# EAGLE design can bus hat (EAGLE 9.1.3)
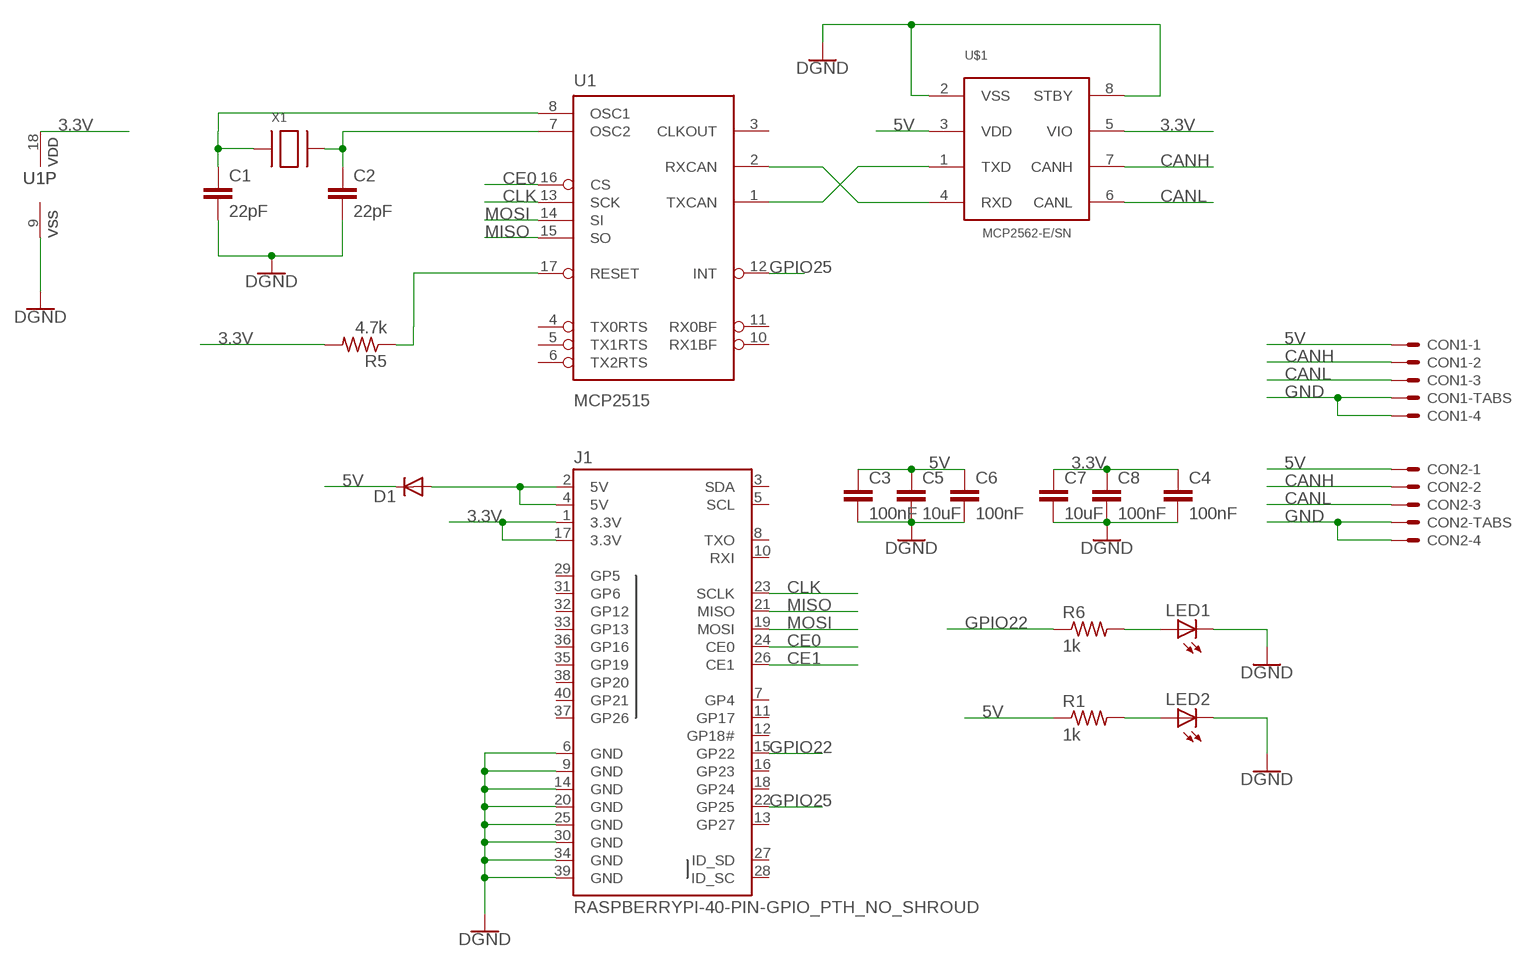
[diagram p0: schematic, sheet 1]

## Parts
C1  22pF  C-EUC0805  [C0805]
C2  22pF  C-EUC0805  [C0805]
C3  100nF  C-EUC0805  [C0805]
C4  100nF  C-EUC0805  [C0805]
C5  10uF  C-EUC0805  [C0805]
C6  100nF  C-EUC0805  [C0805]
C7  10uF  C-EUC0805  [C0805]
C8  100nF  C-EUC0805  [C0805]
CON1  SM04B-GHS-TB  [SM04B-GHS-TB]
CON2  SM04B-GHS-TB  [SM04B-GHS-TB]
D1  DIODE-SOD123  [SOD123]
J1  RASPBERRYPI-40-PIN-GPIO_PTH_NO_SHROUD  [2X20]
LED1  LEDCHIP-LED0805  [CHIP-LED0805]
LED2  LEDCHIP-LED0805  [CHIP-LED0805]
R1  1k  R-US_R0805  [R0805]
R5  4.7k  R-US_R0805  [R0805]
R6  1k  R-US_R0805  [R0805]
U1  MCP2515  MCP2515(MCP2510)SO  [SO18W]
U$1  MCP2562-E/SN  [SOIC8]
X1  XTALNX5032  [NX5032]

## Nets
3.3V: C4.1 C7.1 C8.1 J1.1(3.3V) J1.17(3.3V) R5.2 U1.18(VDD) U$1.5(VIO)
5V: C3.1 C5.1 C6.1 CON1.P$1 CON2.P$1 D1.C R1.1 U$1.3(VDD)
CANH: CON1.P$2 CON2.P$2 U$1.7(CANH)
CANL: CON1.P$3 CON2.P$3 U$1.6(CANL)
CE0: J1.24(CE0) U1.16(CS)
CE1: J1.26(CE1)
CLK: J1.23(SCLK) U1.13(SCK)
GND: C1.2 C2.2 C3.2 C4.2 C5.2 C6.2 C7.2 C8.2 CON1.P$4 CON1.P$5 CON1.P$6 CON2.P$4 CON2.P$5 CON2.P$6 J1.6(GND) J1.9(GND) J1.14(GND) J1.20(GND) J1.25(GND) J1.30(GND) J1.34(GND) J1.39(GND) LED1.C LED2.C U1.9(VSS) U$1.2(VSS) U$1.8(STBY) ; supply symbol labelled DGND
GPIO22: J1.15(GP22) R6.1
GPIO25: J1.22(GP25) U1.12(INT)
MISO: J1.21(MISO) U1.15(SO)
MOSI: J1.19(MOSI) U1.14(SI)
N$1: C1.1 U1.8(OSC1) X1.P$1
N$2: C2.1 U1.7(OSC2) X1.P$2
N$3: U1.1(TXCAN) U$1.1(TXD)
N$4: D1.A J1.2(5V) J1.4(5V)
N$5: U1.2(RXCAN) U$1.4(RXD)
N$6: R5.1 U1.17(RESET)
N$8: LED2.A R1.2
N$10: LED1.A R6.2
Unconnected: J1.3(SDA) J1.5(SCL) J1.7(GP4) J1.8(TXO) J1.10(RXI) J1.11(GP17) J1.12(GP18#) J1.13(GP27) J1.16(GP23) J1.18(GP24) J1.27(ID_SD) J1.28(ID_SC) J1.29(GP5) J1.31(GP6) J1.32(GP12) J1.33(GP13) J1.35(GP19) J1.36(GP16) J1.37(GP26) J1.38(GP20) J1.40(GP21) U1.3(CLKOUT) U1.4(TX0RTS) U1.5(TX1RTS) U1.6(TX2RTS) U1.10(RX1BF) U1.11(RX0BF)

## Library data of the parts
C1-C8 = rcl:C-EU: CAPACITOR, European symbol; SPICEPREFIX: C
CON1 CON2 = ARVP:SM04B-GHS-TB
D1 = _mod_diode:DIODE-: DIODE
J1 = SparkFun-Connectors:RASPBERRYPI-40-PIN-GPIO: Raspberry Pi GPIO Header 2x20 pin connector, as found on B, B+, A+ models. Both shrouded PTH and SMT versions available. SparkFun Products: GPIO Shrouded Header <https://www.sparkfun.com/products/13054>- PTH SparkFun Pi Wedge (Preassembled) <https://www.sparkfun.com/products/13717>
LED1 LED2 = led:LED: LED OSRAM: - CHIPLED LG R971, LG N971, LY N971, LG Q971, LY Q971, LO R971, LY R971 LH N974, LH R974 LS Q976, LO Q976, LY Q976 LO Q996 - Hyper CHIPLED LW Q18S LB Q993, LB Q99A, LB R99A - SideLED LS A670, LO A670, LY A670, LG A670, LP A670 LB A673, LV A673, LT A673, LW A673 LH A674 LY A675 LS A676, LA A676, LO A676, LY A676, LW A676 LS A679, LY A679, LG A679 - Hyper Micro SIDELED® LS Y876, LA Y876, LO Y876, LY Y876 LT Y87S - SmartLED LW L88C, LW L88S LB L89C, LB L89S, LG L890 LS L89K, LO L89K, LY L89K LS L896, LA L896, LO L896, LY L896 - TOPLED LS T670, LO T670, LY T670, LG T670, LP T670 LSG T670, LSP T670, LSY T670, LOP T670, LYG T670 LG T671, LOG T671, LSG T671 LB T673, LV T673, LT T673, LW T673 LH T674 LS T676, LA T676, LO T676, LY T676, LB T676, LH T676, LSB T676, LW T676 LB T67C, LV T67C, LT T67C, LS T67K, LO T67K, LY T67K, LW E67C LS E67B, LA E67B, LO E67B, LY E67B, LB E67C, LV E67C, LT E67C LW T67C LS T679, LY T679, LG T679 LS T770, LO T770, LY T770, LG T770, LP T770 LB T773, LV T773, LT T773, LW T773 LH T774 LS E675, LA E675, LY E675, LS T675 LS T776, LA T776, LO T776, LY T776, LB T776 LHGB T686 LT T68C, LB T68C - Hyper Mini TOPLED® LB M676 - Mini TOPLED Santana® LG M470 LS M47K, LO M47K, LY M47K Source: http://www.osram.convergy.de LUXEON: - LUMILED® LXK2-PW12-R00, LXK2-PW12-S00, LXK2-PW14-U00, LXK2-PW14-V00 LXK2-PM12-R00, LXK2-PM12-S00, LXK2-PM14-U00 LXK2-PE12-Q00, LXK2-PE12-R00, LXK2-PE12-S00, LXK2-PE14-T00, LXK2-PE14-U00 LXK2-PB12-K00, LXK2-PB12-L00, LXK2-PB12-M00, LXK2-PB14-N00, LXK2-PB14-P00, LXK2-PB14-Q00 LXK2-PR12-L00, LXK2-PR12-M00, LXK2-PR14-Q00, LXK2-PR14-R00 LXK2-PD12-Q00, LXK2-PD12-R00, LXK2-PD12-S00 LXK2-PH12-R00, LXK2-PH12-S00 LXK2-PL12-P00, LXK2-PL12-Q00, LXK2-PL12-R00 Source: www.luxeon.com KINGBRIGHT: KA-3528ASYC Source: www.kingbright.com
R1 R5 R6 = rcl:R-US_: RESISTOR, American symbol; SPICEPREFIX: R
U1 = SparkFun-IC-Comms:MCP2515(MCP2510): CAN controller with SPI interface The MCP2515 controller supercedes the MCP2510 while addressing all errata associated with it. The two devices are pin compatible, either can be used with this device. 18-pin package SOIC Simple SPI interface to any MCU. One-shot mode ensures message transmission is attempted only once Databyte filtering Start-of-Frame (SOF) output Low-power CMOS Technology Datasheet <http://www.sparkfun.com/datasheets/DevTools/Arduino/MCP2515.pdf> SparkFun Products CAN-BUS Shield <https://www.sparkfun.com/products/13262> (DEV-13262); PROD_ID: IC-09906
U$1 = SPEAR:MCP2562-E/SN
X1 = adafruit:XTAL: Low cost SMT crystals, no capacitors included http://www.ladyada.net/library/eagle

## Board
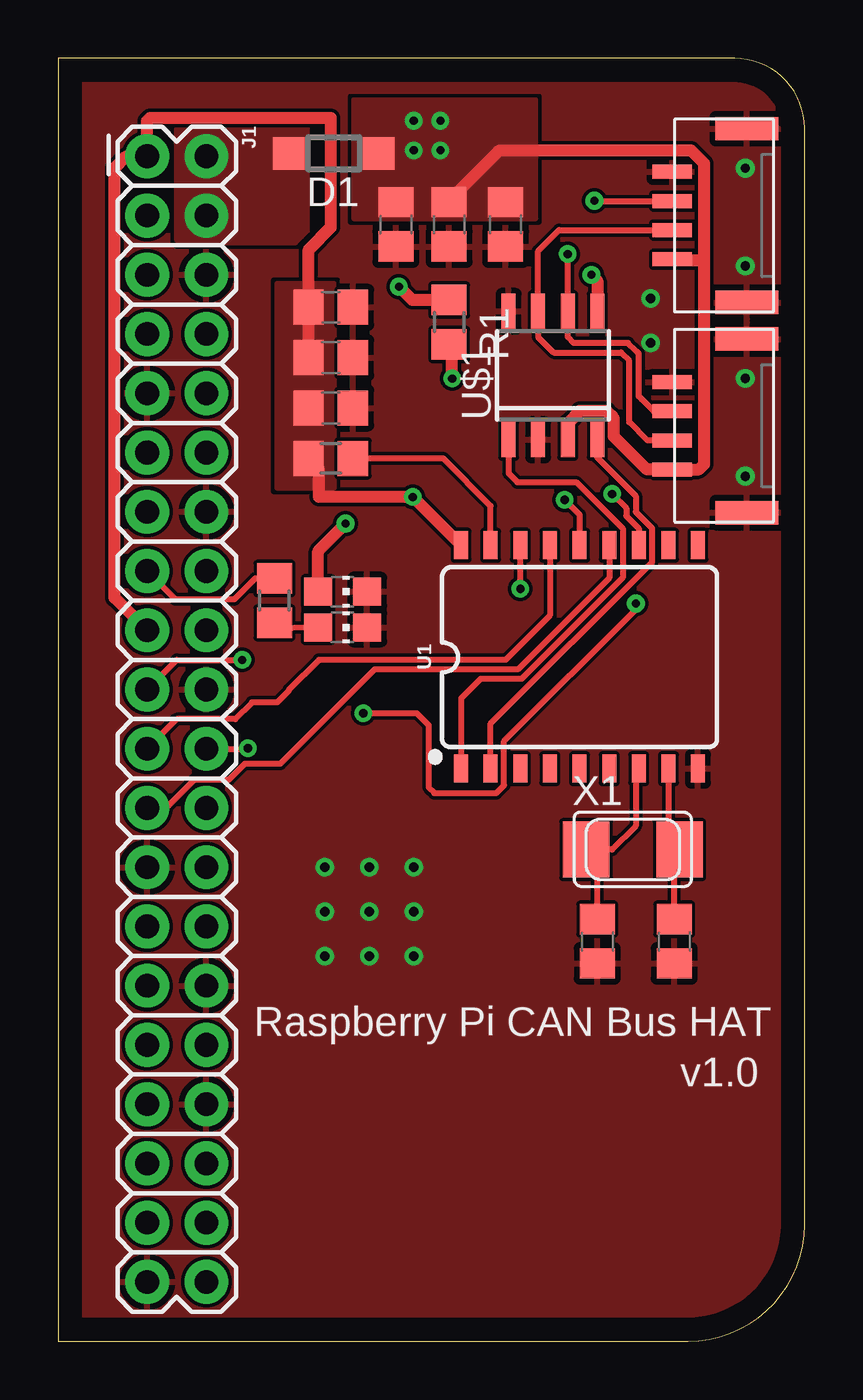
[diagram p1: board, top side]
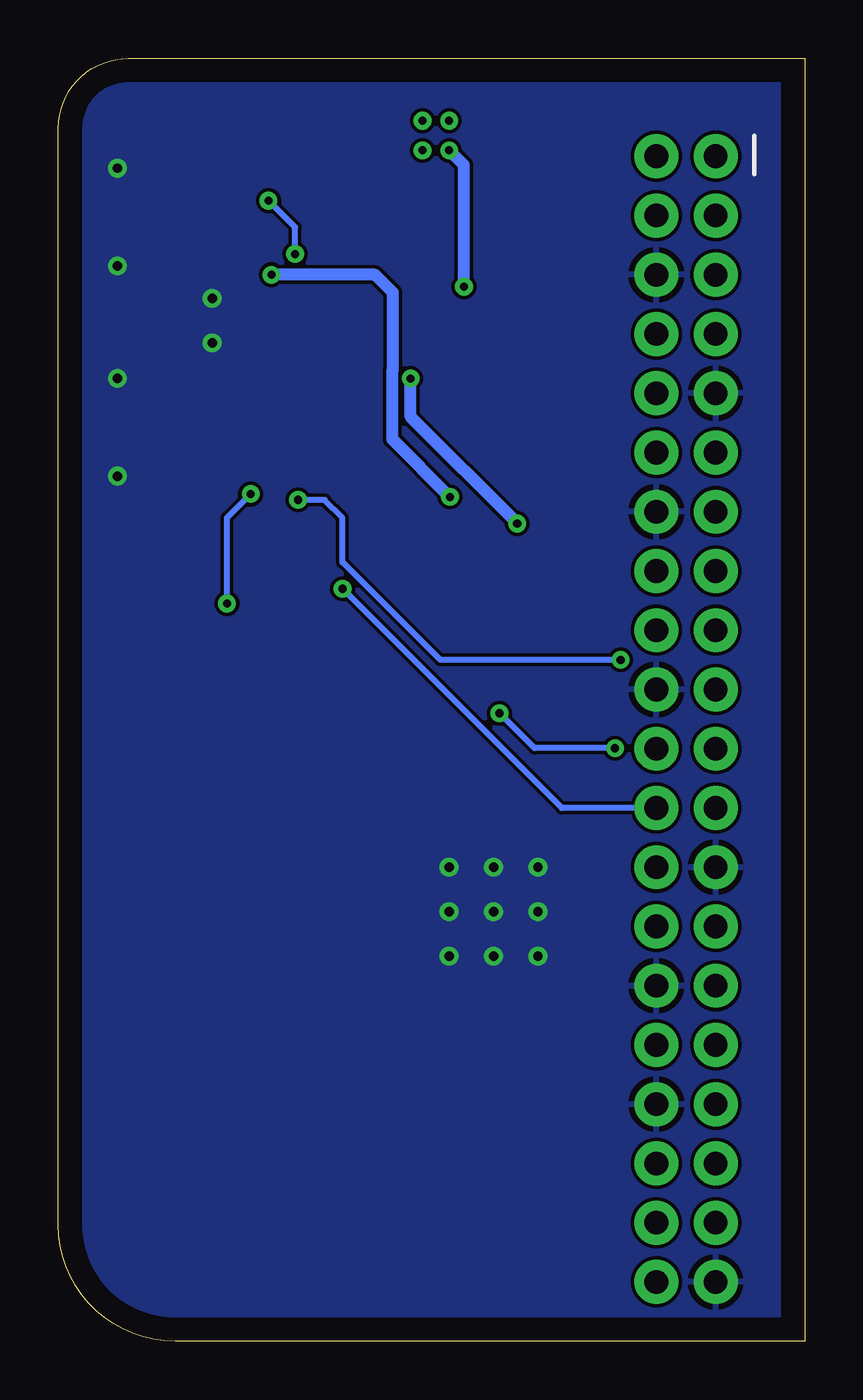
[diagram p2: board, bottom side, seen from below]

Size 32 x 55 mm. Coordinates in mm from the lower left corner, seen from the top.
Outline: 0,0 27,0 arc90 32,5 32,52 arc90 29,55 0,55 0,0
Copper layers (1*16): Top 0.035mm / dielectric 1.5mm / Bottom 0.035mm
Design rules "default": minimum track width 6mil, minimum drill 0.35mm, track to track 6mil, track to pad 6mil, pad to pad 6mil, via to via 6mil, smd to smd 6mil, copper to edge 40mil, drill to drill 6mil, minimum pad ring 10mil, minimum via ring 8mil, stop-mask expansion 4mil, vias tented up to drill 0mil, thermal gap 10mil

### Footprints (pad centres in the part's own frame; a part is rotated, then mirrored left to right if it is on the bottom)
C0805 = smd 1.3 x 1.5: 1 -0.95,0; 2 0.95,0
SM04B-GHS-TB = smd 0.6 x 1.7: P$1 -1.875,0.85; P$2 -0.625,0.85; P$3 0.625,0.85; P$4 1.875,0.85 | smd 1 x 2.7: P$5 -3.725,-2.35; P$6 3.725,-2.35
SOD123 = smd 1.4 x 1.4: A 1.9,0; C -1.9,0
2X20 = drill 1.016 pad 1.88: 1 0,0; 2 0,2.54; 3 2.54,0; 4 2.54,2.54; 5 5.08,0; 6 5.08,2.54; 7 7.62,0; 8 7.62,2.54; 9 10.16,0; 10 10.16,2.54; 11 12.7,0; 12 12.7,2.54; 13 15.24,0; 14 15.24,2.54; 15 17.78,0; 16 17.78,2.54; 17 20.32,0; 18 20.32,2.54; 19 22.86,0; 20 22.86,2.54; 21 25.4,0; 22 25.4,2.54; 23 27.94,0; 24 27.94,2.54; 25 30.48,0; 26 30.48,2.54; 27 33.02,0; 28 33.02,2.54; 29 35.56,0; 30 35.56,2.54; 31 38.1,0; 32 38.1,2.54; 33 40.64,0; 34 40.64,2.54; 35 43.18,0; 36 43.18,2.54; 37 45.72,0; 38 45.72,2.54; 39 48.26,0; 40 48.26,2.54
CHIP-LED0805 = smd 1.2 x 1.2: A 0,-1.05; C 0,1.05
R0805 = smd 1.3 x 1.5: 1 -0.95,0; 2 0.95,0
SO18W = smd 0.6 x 1.2: 1 -5.08,-4.788; 2 -3.81,-4.788; 3 -2.54,-4.788; 4 -1.27,-4.788; 5 0,-4.788; 6 1.27,-4.788; 7 2.54,-4.788; 8 3.81,-4.788; 9 5.08,-4.788; 10 5.08,4.788; 11 3.81,4.788; 12 2.54,4.788; 13 1.27,4.788; 14 0,4.788; 15 -1.27,4.788; 16 -2.54,4.788; 17 -3.81,4.788; 18 -5.08,4.788
SOIC8 = smd 0.6 x 1.5: 1 -1.905,-2.75; 2 -0.635,-2.75; 3 0.635,-2.75; 4 1.905,-2.75; 5 1.905,2.75; 6 0.635,2.75; 7 -0.635,2.75; 8 -1.905,2.75
NX5032 = smd 2 x 2.4: P$1 2,0; P$2 -2,0

### Placement (x,y rotation side)
C1  26.42,17.14 270 top
C2  23.11,17.14 270 top
C3  14.48,47.88 270 top
C4  11.68,44.32 0 top
C5  16.76,47.88 270 top
C6  19.18,47.88 270 top
C7  11.68,42.16 0 top
C8  11.68,40.01 0 top
CON1  27.18,48.26 90 top
CON2  27.18,39.24 90 top
D1  11.81,50.93 180 top
J1  3.81,50.8 270 top
LED1  12.19,30.61 270 top
LED2  12.19,32.13 270 top
R1  16.76,43.69 270 top
R5  11.68,37.85 180 top
R6  9.27,31.75 270 top
U1  22.35,29.34 0 top
U$1  21.21,41.4 0 top
X1  24.64,21.08 0 top

### Tracks (layer width: path | path; a pad name or v marks a point on that pad's centre or on a via)
3.3V  (via drill 0.35)
  Top 0.508: U1.18 v15.2,36.2 11.18,36.2 11.18,37.4 R5.2 | C7.1 10.73,46.8 11.68,47.75 11.68,52.45 3.94,52.45 3.81,52.32 J1.1 2.92,50.8 2.41,50.29 2.41,31.88 J1.17 | v22.86,45.72 23.11,45.47 U$1.5
  Bottom 0.508: v15.2,36.2 17.68,38.67 17.68,41.6 17.65,41.62 17.65,44.96 18.41,45.72 v22.86,45.72
  pour Top (no thermals): 11.81,45.34 11.81,36.58 9.4,36.58 9.4,45.34
5V  (via drill 0.35)
  Top 0.508: C5.1 16.76,48.9 18.92,51.05 27.13,51.05 27.69,50.5 27.69,46.35 | 27.69,46.35 27.69,37.59 27.46,37.37 CON2.P$1 25.24,37.37 23.82,38.79 23.82,39.57 23.51,39.88 22.35,39.88 21.84,39.37 U$1.3 | CON1.P$1 26.36,46.35 27.69,46.35 | R1.1 15.18,44.64 v14.61,45.21
  Bottom 0.508: v14.61,45.21 14.61,50.42 v15.24,51.05
  other vias: 15.24,52.32 16.38,52.32 16.38,51.05
  pour Top (no thermals): 12.7,48.39 12.7,53.21 20.45,53.21 20.45,48.13 12.7,48.13 12.7,48.26
CANH
  Top 0.254: 26.32,47.62 CON1.P$2 21.47,47.63 20.57,46.74 U$1.7 20.57,43.05 21.23,42.39 24.13,42.39 24.49,42.04 24.49,39.4 25.26,38.62 CON2.P$2 25.59,38.62
CANL  (via drill 0.35)
  Top 0.254: v21.84,46.61 U$1.6 21.84,43.05 22.1,42.8 24.43,42.8 24.79,42.44 24.89,42.34 24.89,40.51 25.02,40.39 25.54,39.87 CON2.P$3 | v22.99,48.9 23,48.88 CON1.P$3
  Bottom 0.254: v21.84,46.61 21.84,47.75 v22.99,48.9
CE0  (via drill 0.35)
  Top 0.254: v19.81,32.26 U1.16
  Bottom 0.254: J1.24 10.41,22.86 v19.81,32.26
CLK
  Top 0.254: J1.23 4.63,22.86 5.84,24.08 7.32,24.08 8,24.77 9.53,24.77 13.56,28.8 19.7,28.8 23.62,32.73 U1.13
GND  (via drill 0.4)
  other vias: 11.43,20.32 15.24,20.32 11.43,16.51 15.24,16.51 13.34,18.41 11.43,18.41 13.34,20.32 15.24,18.41 13.34,16.51 29.46,50.29 29.46,46.1 29.46,41.27 29.46,37.08 25.4,42.8 25.4,44.7
  pour Bottom: 0,55.24 0,-0.25 29.84,-0.25 32.51,2.41 32.51,52.83 29.97,55.37 0.13,55.37
  pour Top (rank 3): 0,55.88 0,-0.76 0.13,-0.89 29.72,-0.89 33.15,2.54 33.15,52.96 30.1,56.01 0,56.01
GPIO22
  Top 0.254: R6.1 8.44,32.7 7.54,31.8 5.03,31.8 J1.15
GPIO25  (via drill 0.35)
  Top 0.254: J1.22 8.11,25.4 v8.13,25.42 | v13.08,26.92 15.37,26.92 15.88,26.42 15.88,23.75 16.13,23.5 18.78,23.5 19.12,23.83 19.12,25.73 24.77,31.37 v24.77,31.62 | v23.75,36.32 24.36,35.71 24.36,35.38 24.89,34.84 U1.12
  Bottom 0.254: v8.13,25.42 11.58,25.42 v13.08,26.92 | v24.77,31.62 24.77,35.31 v23.75,36.32
MISO
  Top 0.254: U1.15 21.08,31.11 19.18,29.21 11.18,29.21 9.9,27.93 9.9,27.89 9.39,27.39 8.3,27.39 7.58,26.67 5.08,26.67 J1.21
MOSI  (via drill 0.35)
  Top 0.254: J1.19 5.08,29.21 v7.89,29.21 | v21.72,36.07 22.35,35.43 U1.14
  Bottom 0.254: v7.89,29.21 15.62,29.21 19.81,33.4 19.81,35.31 20.57,36.07 v21.72,36.07
N$1
  Top 0.254: X1.P$1 26.64,21.21 26.42,20.99 | C1.1 26.42,20.99 | U1.8 26.16,21.24 26.42,20.99
N$2
  Top 0.254: U1.7 24.77,24.42 24.77,22.1 23.75,21.08 22.86,21.08 | 22.86,21.08 X1.P$2 | C2.1 23.11,20.83 22.86,21.08
N$3
  Top 0.254: U1.1 17.27,27.56 18.11,28.4 19.87,28.4 24.2,32.73 24.2,34.84 22.21,36.83 19.68,36.83 19.3,37.21 U$1.1
N$4
  pour Top (no thermals): 5.08,51.94 5.08,47.24 5.21,47.12 10.16,47.12 10.41,47.37 10.67,47.62 10.67,52.07 5.21,52.07
N$5
  Top 0.254: U1.2 18.54,26.48 25.47,33.41 25.47,34.84 24.77,35.55 24.77,36.24 23.11,37.89 U$1.4
N$6
  Top 0.254: U1.17 18.54,35.81 16.51,37.85 R5.1
N$8  (via drill 0.35)
  Top 0.508: v16.89,41.27 16.89,42.61 R1.2 | LED2.A 11.14,33.88 v12.32,35.05
  Bottom 0.508: v12.32,35.05 16.89,39.62 v16.89,41.27
N$10
  Top 0.254: LED1.A 9.02,30.55 R6.2

### Text on the board
tPlace: Raspberry Pi CAN Bus HAT | v1.0